# Altium schematic sheet Main_Sheet.SchDoc: Projet M1 2024
size A4; ApprovedBy: Baptiste GADEBILLE; CheckedBy: Baptiste GADEBILLE; Author: Baptiste GADEBILLE; DrawnBy: J.CLEMENT & D.FOURNIER; DocumentNumber: 1; Revision: V1.0 Rev A; SheetNumber: 1; SheetTotal: 5
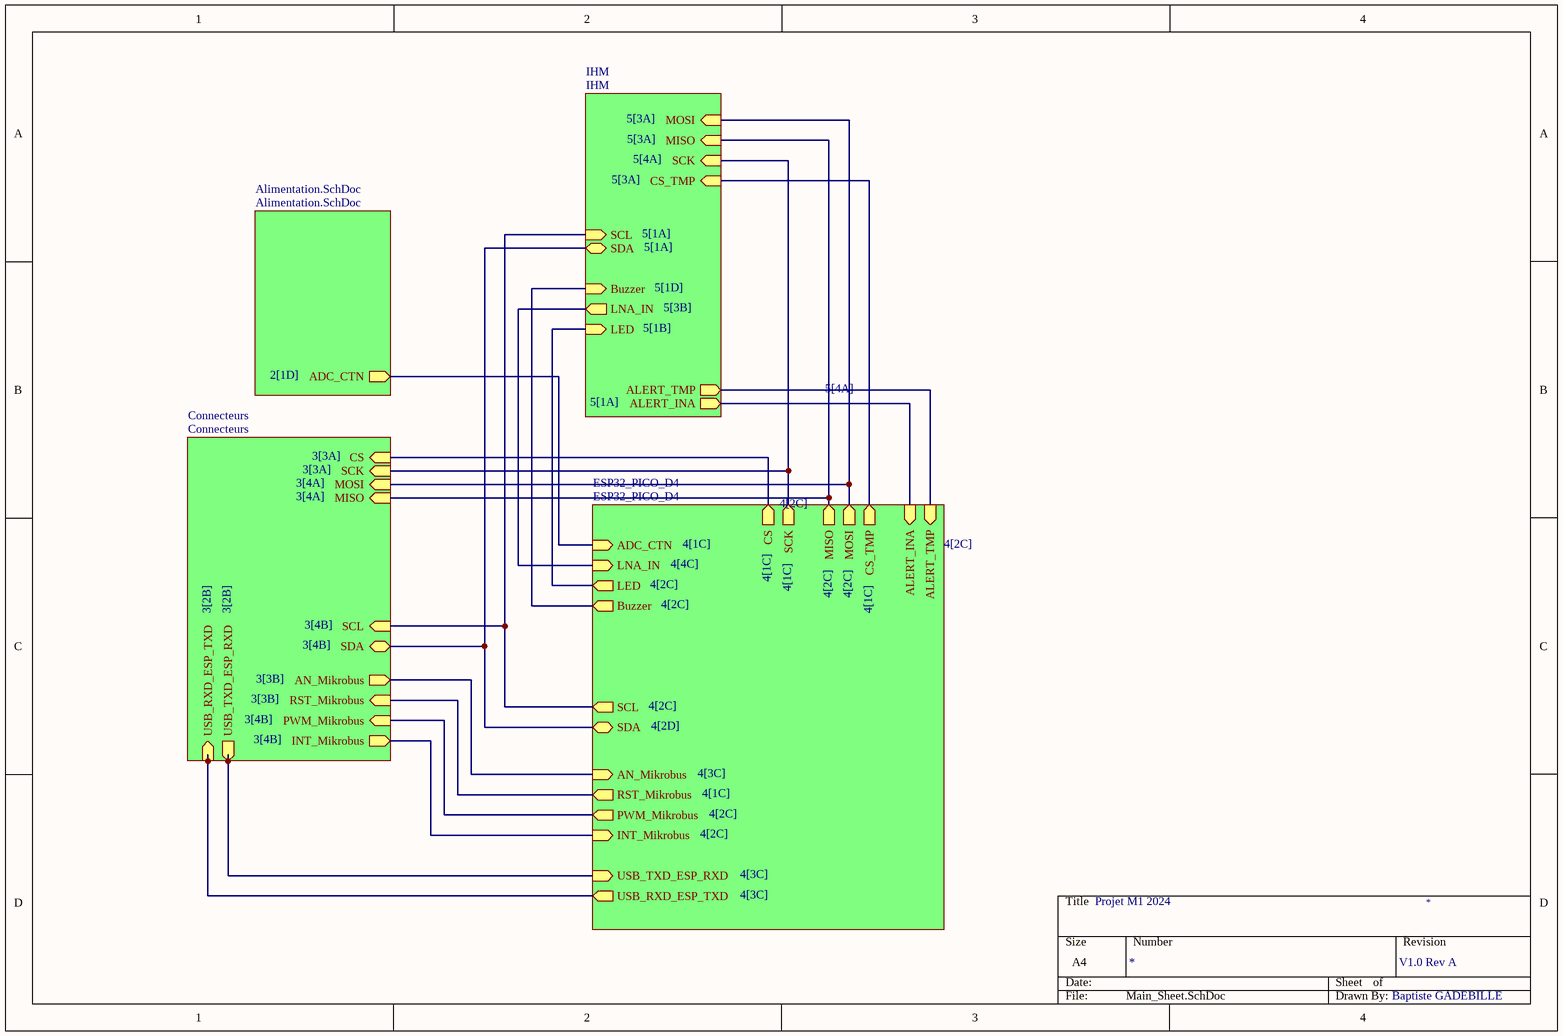
[diagram p0: Main_Sheet.SchDoc]

## Sub-sheets
Alimentation.SchDoc = Alimentation.SchDoc: ADC_CTN (out)
Connecteurs = Connecteurs: USB_TXD_ESP_RXD (out), USB_RXD_ESP_TXD (in), SCL (in), CS (in), SCK (in), MISO (in), MOSI (in), AN_Mikrobus (out), RST_Mikrobus (in), PWM_Mikrobus (in), INT_Mikrobus (out), SDA (bidir)
ESP32_PICO_D4 = ESP32_PICO_D4: USB_TXD_ESP_RXD (in), USB_RXD_ESP_TXD (out), SCL (out), SDA (bidir), CS (out), SCK (out), MISO (out), MOSI (out), AN_Mikrobus (in), RST_Mikrobus (out), PWM_Mikrobus (out), INT_Mikrobus (in), ADC_CTN (in), LNA_IN (in), LED (out), Buzzer (out), CS_TMP (out), ALERT_TMP (in), ALERT_INA (in)
IHM = IHM: MOSI (in), MISO (in), SCK (in), CS_TMP (in), ALERT_TMP (out), ALERT_INA (out), SDA (bidir), SCL (in), LNA_IN (out), LED (in), Buzzer (in)

## Nets
(unnamed): sheet Alimentation.SchDoc/ADC_CTN, sheet ESP32_PICO_D4/ADC_CTN
(unnamed): sheet Connecteurs/USB_TXD_ESP_RXD, sheet ESP32_PICO_D4/USB_TXD_ESP_RXD
(unnamed): sheet Connecteurs/USB_RXD_ESP_TXD, sheet ESP32_PICO_D4/USB_RXD_ESP_TXD
(unnamed): sheet Connecteurs/SCL, sheet IHM/SCL, sheet ESP32_PICO_D4/SCL
(unnamed): sheet Connecteurs/CS, sheet ESP32_PICO_D4/CS
(unnamed): sheet Connecteurs/SCK, sheet IHM/SCK, sheet ESP32_PICO_D4/SCK
(unnamed): sheet Connecteurs/MISO, sheet IHM/MISO, sheet ESP32_PICO_D4/MISO
(unnamed): sheet Connecteurs/MOSI, sheet IHM/MOSI, sheet ESP32_PICO_D4/MOSI
(unnamed): sheet Connecteurs/AN_Mikrobus, sheet ESP32_PICO_D4/AN_Mikrobus
(unnamed): sheet Connecteurs/RST_Mikrobus, sheet ESP32_PICO_D4/RST_Mikrobus
(unnamed): sheet Connecteurs/PWM_Mikrobus, sheet ESP32_PICO_D4/PWM_Mikrobus
(unnamed): sheet Connecteurs/INT_Mikrobus, sheet ESP32_PICO_D4/INT_Mikrobus
(unnamed): sheet Connecteurs/SDA, sheet IHM/SDA, sheet ESP32_PICO_D4/SDA
(unnamed): sheet IHM/CS_TMP, sheet ESP32_PICO_D4/CS_TMP
(unnamed): sheet IHM/ALERT_TMP, sheet ESP32_PICO_D4/ALERT_TMP
(unnamed): sheet IHM/ALERT_INA, sheet ESP32_PICO_D4/ALERT_INA
(unnamed): sheet IHM/LNA_IN, sheet ESP32_PICO_D4/LNA_IN
(unnamed): sheet IHM/LED, sheet ESP32_PICO_D4/LED
(unnamed): sheet IHM/Buzzer, sheet ESP32_PICO_D4/Buzzer